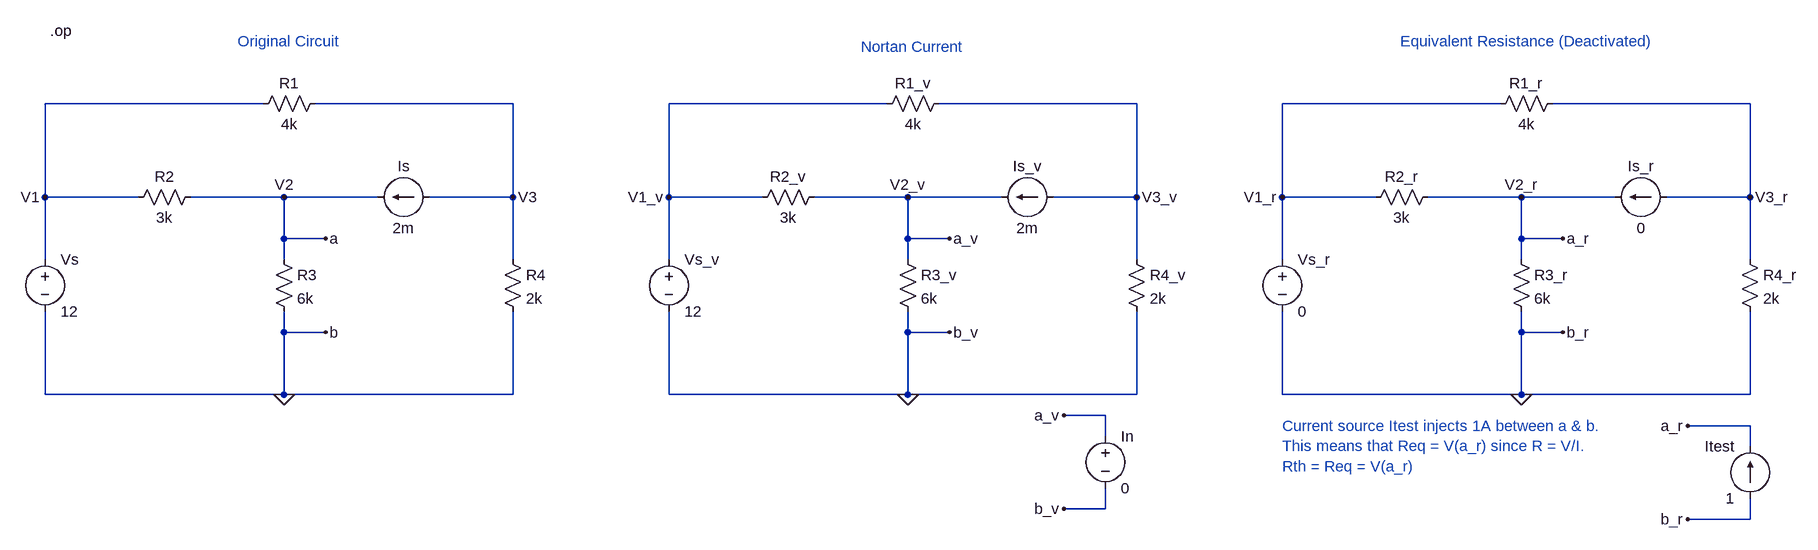
[diagram p0: schematic HW04P01.asc]
HW04P01.asc, the LTspice schematic file:
Version 4
SHEET 1 2932 680
WIRE -800 -432 -1136 -432
WIRE -416 -432 -720 -432
WIRE 160 -432 -176 -432
WIRE 544 -432 240 -432
WIRE 1104 -432 768 -432
WIRE 1488 -432 1184 -432
WIRE -1136 -288 -1136 -432
WIRE -992 -288 -1136 -288
WIRE -768 -288 -912 -288
WIRE -624 -288 -768 -288
WIRE -416 -288 -416 -432
WIRE -416 -288 -544 -288
WIRE -176 -288 -176 -432
WIRE -32 -288 -176 -288
WIRE 192 -288 48 -288
WIRE 336 -288 192 -288
WIRE 544 -288 544 -432
WIRE 544 -288 416 -288
WIRE 768 -288 768 -432
WIRE 912 -288 768 -288
WIRE 1136 -288 992 -288
WIRE 1280 -288 1136 -288
WIRE 1488 -288 1488 -432
WIRE 1488 -288 1360 -288
WIRE -768 -224 -768 -288
WIRE -704 -224 -768 -224
WIRE 192 -224 192 -288
WIRE 256 -224 192 -224
WIRE 1136 -224 1136 -288
WIRE 1200 -224 1136 -224
WIRE -1136 -192 -1136 -288
WIRE -768 -192 -768 -224
WIRE -416 -192 -416 -288
WIRE -176 -192 -176 -288
WIRE 192 -192 192 -224
WIRE 544 -192 544 -288
WIRE 768 -192 768 -288
WIRE 1136 -192 1136 -224
WIRE 1488 -192 1488 -288
WIRE -768 -80 -768 -112
WIRE -704 -80 -768 -80
WIRE 192 -80 192 -112
WIRE 256 -80 192 -80
WIRE 1136 -80 1136 -112
WIRE 1200 -80 1136 -80
WIRE -1136 16 -1136 -112
WIRE -768 16 -768 -80
WIRE -768 16 -1136 16
WIRE -416 16 -416 -112
WIRE -416 16 -768 16
WIRE -176 16 -176 -112
WIRE 192 16 192 -80
WIRE 192 16 -176 16
WIRE 544 16 544 -112
WIRE 544 16 192 16
WIRE 768 16 768 -112
WIRE 1136 16 1136 -80
WIRE 1136 16 768 16
WIRE 1488 16 1488 -112
WIRE 1488 16 1136 16
WIRE 496 48 432 48
WIRE 1488 64 1392 64
WIRE 496 80 496 48
WIRE 1488 96 1488 64
WIRE 496 192 496 160
WIRE 496 192 432 192
WIRE 1488 208 1488 176
WIRE 1488 208 1392 208
FLAG -704 -224 a
FLAG -704 -80 b
FLAG -768 16 0
FLAG 256 -224 a_v
FLAG 256 -80 b_v
FLAG 192 16 0
FLAG -1136 -288 V1
FLAG -768 -288 V2
FLAG -416 -288 V3
FLAG -176 -288 V1_v
FLAG 192 -288 V2_v
FLAG 544 -288 V3_v
FLAG 1200 -224 a_r
FLAG 1200 -80 b_r
FLAG 1136 16 0
FLAG 768 -288 V1_r
FLAG 1136 -288 V2_r
FLAG 1488 -288 V3_r
FLAG 1392 64 a_r
FLAG 1392 208 b_r
FLAG 432 48 a_v
FLAG 432 192 b_v
DATAFLAG 1168 -224 ""
DATAFLAG -736 -224 ""
SYMBOL voltage -1136 -208 R0
SYMATTR InstName Vs
SYMATTR Value 12
SYMBOL res -896 -304 R90
WINDOW 0 0 56 VBottom 2
WINDOW 3 32 56 VTop 2
SYMATTR InstName R2
SYMATTR Value 3k
SYMBOL current -544 -288 R90
WINDOW 0 -32 40 VBottom 2
WINDOW 3 32 40 VTop 2
SYMATTR InstName Is
SYMATTR Value 2m
SYMBOL res -704 -448 R90
WINDOW 0 0 56 VBottom 2
WINDOW 3 32 56 VTop 2
SYMATTR InstName R1
SYMATTR Value 4k
SYMBOL res -784 -208 R0
SYMATTR InstName R3
SYMATTR Value 6k
SYMBOL res -432 -208 R0
SYMATTR InstName R4
SYMATTR Value 2k
SYMBOL voltage -176 -208 R0
SYMATTR InstName Vs_v
SYMATTR Value 12
SYMBOL res 64 -304 R90
WINDOW 0 0 56 VBottom 2
WINDOW 3 32 56 VTop 2
SYMATTR InstName R2_v
SYMATTR Value 3k
SYMBOL current 416 -288 R90
WINDOW 0 -32 40 VBottom 2
WINDOW 3 32 40 VTop 2
SYMATTR InstName Is_v
SYMATTR Value 2m
SYMBOL res 256 -448 R90
WINDOW 0 0 56 VBottom 2
WINDOW 3 32 56 VTop 2
SYMATTR InstName R1_v
SYMATTR Value 4k
SYMBOL res 528 -208 R0
SYMATTR InstName R4_v
SYMATTR Value 2k
SYMBOL voltage 768 -208 R0
SYMATTR InstName Vs_r
SYMATTR Value 0
SYMBOL res 1008 -304 R90
WINDOW 0 0 56 VBottom 2
WINDOW 3 32 56 VTop 2
SYMATTR InstName R2_r
SYMATTR Value 3k
SYMBOL res 1200 -448 R90
WINDOW 0 0 56 VBottom 2
WINDOW 3 32 56 VTop 2
SYMATTR InstName R1_r
SYMATTR Value 4k
SYMBOL res 1120 -208 R0
SYMATTR InstName R3_r
SYMATTR Value 6k
SYMBOL res 1472 -208 R0
SYMATTR InstName R4_r
SYMATTR Value 2k
SYMBOL current 1488 176 R180
WINDOW 0 24 80 Left 2
WINDOW 3 24 0 Left 2
SYMATTR InstName Itest
SYMATTR Value 1
SYMBOL res 176 -208 R0
SYMATTR InstName R3_v
SYMATTR Value 6k
SYMBOL current 1360 -288 R90
WINDOW 0 -32 40 VBottom 2
WINDOW 3 32 40 VTop 2
SYMATTR InstName Is_r
SYMATTR Value 0
SYMBOL voltage 496 64 R0
SYMATTR InstName In
SYMATTR Value 0
TEXT -1128 -544 Left 2 !.op
TEXT -760 -528 Center 2 ;Original Circuit
TEXT 200 -520 Center 2 ;Nortan Current
TEXT 1144 -528 Center 2 ;Equivalent Resistance (Deactivated)
TEXT 768 64 Left 2 ;Current source Itest injects 1A between a & b.\nThis means that Req = V(a_r) since R = V/I.\nRth = Req = V(a_r)

The netlist it stands for:
* HW04P01.asc
Vs V1 0 12
R2 V2 V1 3k
Is V3 V2 2m
R1 V3 V1 4k
R3 V2 0 6k
R4 V3 0 2k
Vs_v V1_v 0 12
R2_v V2_v V1_v 3k
Is_v V3_v V2_v 2m
R1_v V3_v V1_v 4k
R4_v V3_v 0 2k
Vs_r V1_r 0 0
R2_r V2_r V1_r 3k
R1_r V3_r V1_r 4k
R3_r V2_r 0 6k
R4_r V3_r 0 2k
Itest 0 V2_r 1
R3_v V2_v 0 6k
Is_r V3_r V2_r 0
V§In V2_v 0 0
.op
* Original Circuit
* Nortan Current
* Equivalent Resistance (Deactivated)
* Current source Itest injects 1A between a & b.
* This means that Req = V(a_r) since R = V/I.
* Rth = Req = V(a_r)
.backanno
.end